# Altium schematic sheet Thruster Board.SchDoc
size A; Organization: Underwater Robotics; Address1: c/o Student Involvement; Address2: Campus Box 7306; Address3: 2016 Cates Ave. Raleigh, NC 27695; Revision: A1; SheetNumber: 1F; SheetTotal: 5F
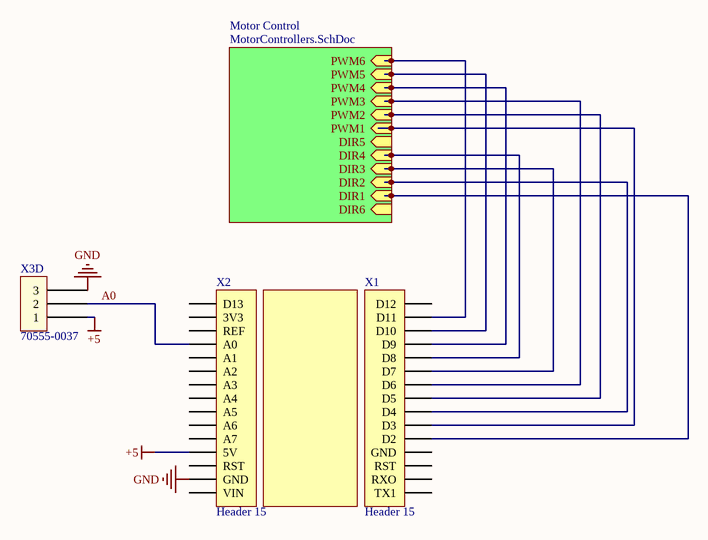
[diagram p0: Thruster Board.SchDoc]

## Parts
X1  Header 15  [HDR1X15]
X2  Header 15  [HDR1X15]
X3D  70555-0037  [70555-0037]

## Sub-sheets
Motor Control = MotorControllers.SchDoc: PWM1 (in), PWM2 (in), PWM3 (in), PWM4 (in), PWM5 (in), DIR1 (in), DIR2 (in), DIR3 (in), DIR4 (in), DIR5 (in), DIR6 (in), PWM6 (in)

## Nets
+5: X2.12(5V) X3D.1
GND: X2.14(GND) X3D.3
A0: X2.?1(A0) X3D.2
NetX1_5: X1.5(D2) ; sheet Motor Control/DIR1
NetX1_6: X1.6(D3) ; sheet Motor Control/PWM1
NetX1_7: X1.7(D4) ; sheet Motor Control/DIR2
NetX1_8: X1.8(D5) ; sheet Motor Control/PWM2
NetX1_9: X1.9(D6) ; sheet Motor Control/PWM3
NetX1_10: X1.10(D7) ; sheet Motor Control/DIR3
NetX1_11: X1.11(D8) ; sheet Motor Control/DIR4
NetX1_12: X1.12(D9) ; sheet Motor Control/PWM4
NetX1_13: X1.13(D10) ; sheet Motor Control/PWM5
NetX1_14: X1.14(D11) ; sheet Motor Control/PWM6

Not connected (* = marked no-connect by the designer): X1 1(TX1) 2(RXO) 3(RST) 4(GND) 15(D12); X2 1(D13) 2(3V3) 3(REF) 5(A1) 6(A2) 7(A3) 8(A4) 9(A5) 10(A6) 11(A7) 13(RST) 15(VIN)

## Notes on the sheet
- Title
- Size:
- Date:
- A
- Number:
- Time:
- Revision:
- Sheet
- of
- File:

## Library data of the parts
X1 X2 = Header 15: Header, 15-Pin; LatestRevisionDate: 17-Jul-2002; LatestRevisionNote: Re-released for DXP Platform.; Publisher: Altium Limited
X3D = 70555-0037: Molex, C-Grid SL 70555, 3 Pin; Product Range: SL 70555 Series; Contact Termination Type: Through Hole; Gender: Header; No. of Contacts: 3; Pitch Spacing: 2.54; No. of Rows: 1; Supplier 1: Newark; Supplier Part Number 1: 59H2958; Manufacturer: MOLEX; RoHS: YES; Stock 1: 1580; Pricing 1: 1=0.679, 10=0.622, 100=0.575, 500=0.575, 1000=0.534, 2000=0.495, 5000=0.484, 10000=0.47 (USD); Contact Plating: Gold Plated Contacts; ComponentLink1URL: http://www.farnell.com/cad/1737917.pdf; ComponentLink1Description: http://www.farnell.com/cad/1737917.pdf; ComponentLink2URL: http://www.farnell.com/datasheets/1947503.pdf; ComponentLink2Description: http://www.farnell.com/datasheets/1947503.pdf; ComponentLink3URL: http://www.farnell.com/cad/1980011.zip; ComponentLink3Description: http://www.farnell.com/cad/1980011.zip